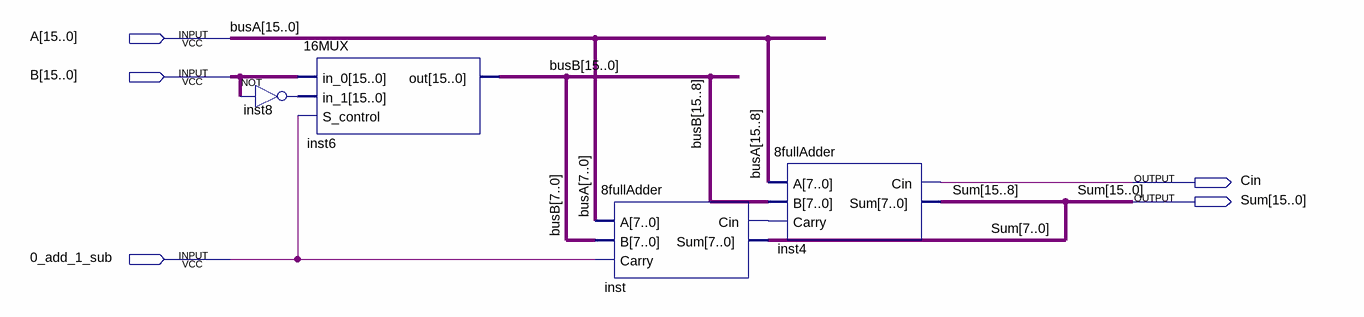
[diagram p0: schematic sheet]
// Quartus schematic 16AddSub.bdf as structural Verilog: 4 symbols, 5 pins
module \16AddSub  (
  input  [15:0] A,
  input  [15:0] B,
  input  \0_add_1_sub ,
  output Cin,
  output [15:0] Sum
);

  wire inst_cin;
  wire [15:0] busB, inst8_out;

  assign inst8_out = ~B;  // NOT inst8, 16 bits wide
  \16MUX  inst6 (.in_0(B), .in_1(inst8_out), .S_control(\0_add_1_sub ), .out(busB));
  \8fullAdder  inst (.A(A[7:0]), .B(busB[7:0]), .Carry(\0_add_1_sub ), .Cin(inst_cin), .Sum(Sum[7:0]));
  \8fullAdder  inst4 (.A(A[15:8]), .B(busB[15:8]), .Carry(inst_cin), .Cin(Cin), .Sum(Sum[15:8]));

  // Other names for the same wires on the sheet: busA[15:0] = A
endmodule
